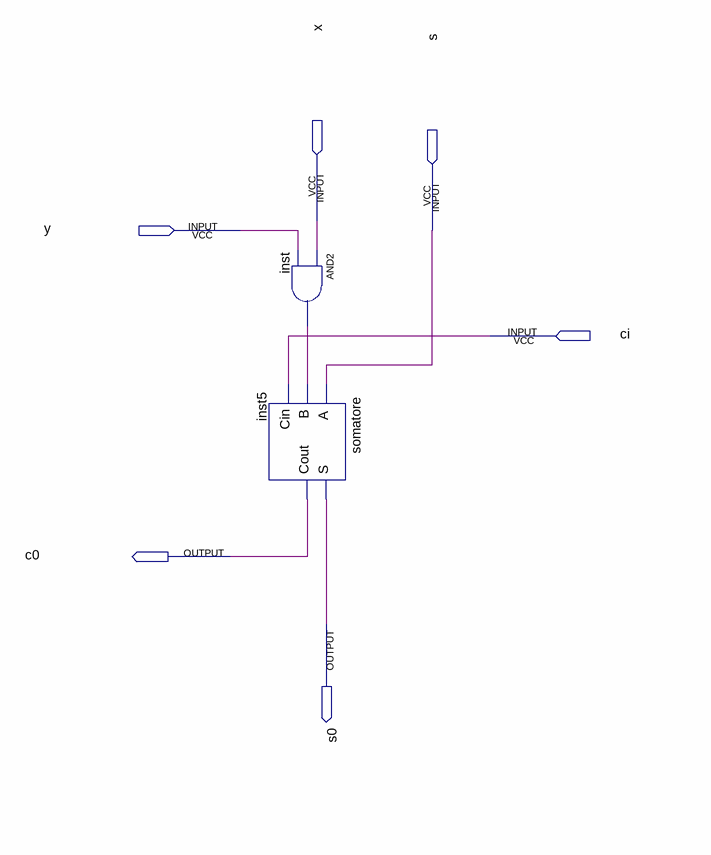
[diagram p0: schematic sheet]
// Quartus schematic somadorcompleto.bdf as structural Verilog: 2 symbols, 6 pins
module somadorcompleto (
  input  x,
  input  y,
  input  s,
  input  ci,
  output c0,
  output s0
);

  wire inst_out;

  somatore inst5 (.A(s), .B(inst_out), .Cin(ci), .S(s0), .Cout(c0));
  and inst (inst_out, x, y);
endmodule
